# Altium schematic sheet Electronics Heater.SchDoc
size A3
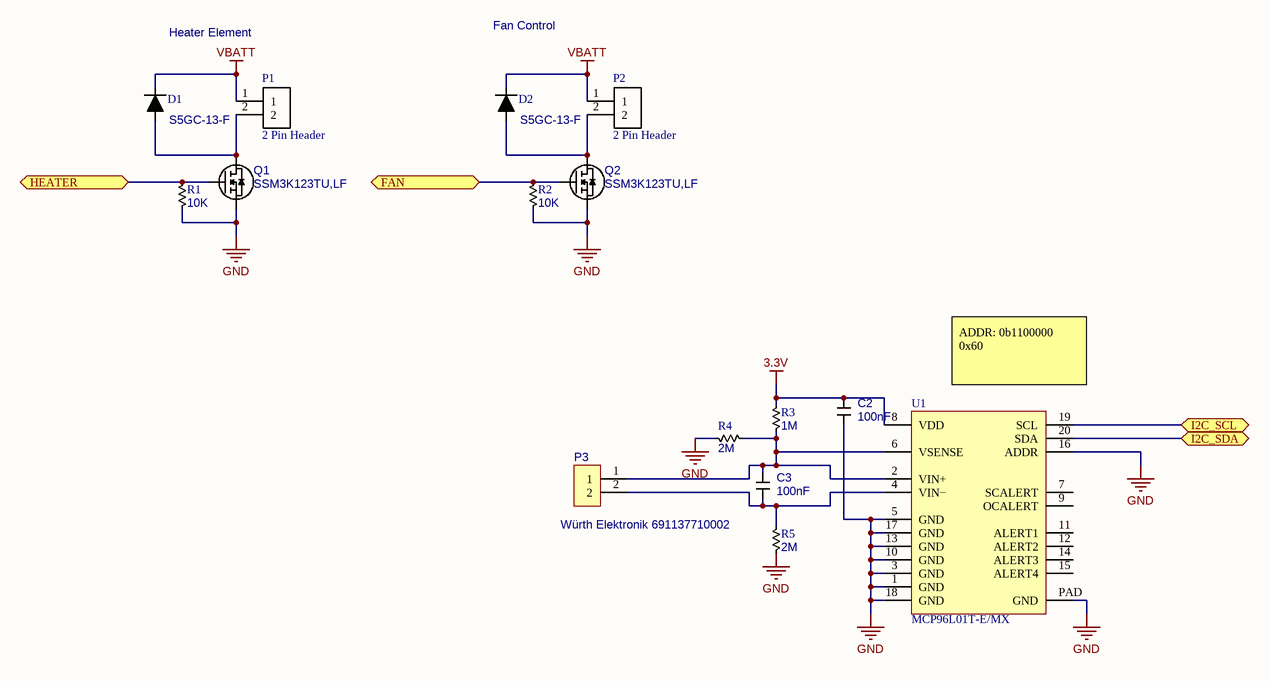
[diagram p0: Electronics Heater.SchDoc]

## Parts
?  (no value)
C2  100nF  [C0805]
C3  100nF  [C0805]
D1  S5GC-13-F  [SMC]
D2  S5GC-13-F  [SMC]
P1  2 Pin Header  [S2B-XH-A(LF)(SN)]
P2  2 Pin Header  [S2B-XH-A(LF)(SN)]
P3  Würth Elektronik 691137710002  [Würth Elektronik 691137710002]
Q1  SSM3K123TU,LF  [SSM3K123TU,LF]
Q2  SSM3K123TU,LF  [SSM3K123TU,LF]
R1  Resistance: 10K  [R0805]  (hidden comment: 330Ω)
R2  Resistance: 10K  [R0805]  (hidden comment: 330Ω)
R3  Resistance: 1M  [R0805]  (hidden comment: 330Ω)
R4  Resistance: 2M  [R0805]  (hidden comment: 330Ω)
R5  Resistance: 2M  [R0805]  (hidden comment: 330Ω)
U1  MCP96L01T-E/MX  [MCP96L01T-E/MX]

## Ports
FAN, HEATER, I2C_SCL, I2C_SDA

## Nets
3.3V: C2.1 R3.2 U1.8(VDD)
GND: C2.2 Q1.2 Q2.2 R1.1 R2.1 R4.2 R5.2 U1.1(GND) U1.3(GND) U1.5(GND) U1.10(GND) U1.13(GND) U1.16(ADDR) U1.17(GND) U1.18(GND) U1.PAD(GND)
VBATT: D1.1 D2.1 P1.1 P2.1
FAN: Q2.1 R2.2 ; port FAN
HEATER: Q1.1 R1.2 ; port HEATER
I2C_SCL: U1.19(SCL) ; port I2C_SCL
I2C_SDA: U1.20(SDA) ; port I2C_SDA
NetC3_1: C3.1 P3.1 R3.1 R4.1 U1.2(VIN+) U1.6(VSENSE)
NetC3_2: C3.2 P3.2 R5.1 U1.4(VIN−)
NetD1_2: D1.2 P1.2 Q1.3
NetD2_2: D2.2 P2.2 Q2.3

Not connected (* = marked no-connect by the designer): U1 7(SCALERT) 9(OCALERT) 11(ALERT1) 12(ALERT2) 14(ALERT3) 15(ALERT4)

## Notes on the sheet
- Heater Element
- Fan Control
- (near U1) ADDR: 0b1100000
  0x60
- DRAWN BY
- CHECKED BY
- DATE
- TITLE
- Title
- Size:
- Date:
- A3
- Number:
- Time:
- Revision:
- Sheet
- of
- APPROVED BY
- RELEASED BY
- SCALE:
- SIZE
- DRAWING NUMBER
- SHEET
- -
- OF
- File:

## Library data of the parts
? = Title Block
C2 C3 = Capacitor: Manufacturer: YAGEO; Manufacturer Part Number: CC0805KRX7R9BB104; Tolerance: ±10%; Temperature Coefficient: X7R; Voltage Rating: 50V; Supplier: Digi-Key Electronics; Supplier Part Number: 311-1140-1-ND; Capacitance: 100nF
D1 D2 = Diode: Manufacturer: Diodes Incorporated; Current Rating: 5A; Voltage: 400V; Supplier: Digi-Key Electronics; Supplier Part Number: S5GC-FDICT-ND; Manufacturer Part Number: S5GC-13-F
P1 P2 = Header 2: Manufacturer: JST Sales America Inc.; Manufacturer Part Number: S2B-XH-A; Supplier: Digi-Key Electronics; Supplier Part Number: 455-S2B-XH-A-ND
P3 = Würth Elektronik 691137710002: 2 Position Wire to Board Terminal Block Horizontal with Board 0.197" (5.00mm) Through Hole; Positions: 2; Voltage Rating: 300V; Current Rating: 16A; Wire Gauge: 12-30AWG; Manufacturer: Würth Elektronik; Manufacturer Part Number: 691137710002; Supplier: Digi-Key Electronics; Supplier Part Number: 732-10955-ND
Q1 Q2 = SSM3K123TU,LF: N-Channel 20 V 4.2A (Ta) 500mW (Ta) Surface Mount UFM; Manufacturer: Toshiba Semiconductor and Storage; Supplier: Digi-Key Electronics; Supplier Part Number: SSM3K123TULFCT-ND; Manufacturer Part Number: SSM3K123TU,LF
R1 R2 = Resistor: Standard Resistor; Manufacturer: YAGEO; Manufacturer Part Number: RC0805JR-0710KL; Power Rating: 1/8W; Supplier: Digi-Key Electronics; Supplier Part Number: 311-10KARCT-ND; Price: 0.16
R3 = Resistor: Standard Resistor; Manufacturer: Panasonic Electronic Components; Manufacturer Part Number: ERA-6AEB105V; Power Rating: 1/8W; Supplier: Digi-Key Electronics; Supplier Part Number: P1MDACT-ND; Price: 0.16
R4 R5 = Resistor: Standard Resistor; Manufacturer: Vishay Dale; Manufacturer Part Number: CRCW08052M00FKECC; Power Rating: 1/8W; Supplier: Digi-Key Electronics; Supplier Part Number: 541-4129-1-ND; Price: 0.16
U1 = MCP96L01T-E/MX: Thermocouple EMF to Temperature Converter,  ±1.5°C Maximum Accuracy; Manufacturer: Microchip Technology; Supplier: Digi-Key Electronics; Manufacturer Part Number: MCP96L01T-E/MX; Supplier Part Number: 150-MCP96L01T-E/MXCT-ND